# EAGLE schematic Steering Wheel V2.3 (EAGLE 7.7.0)
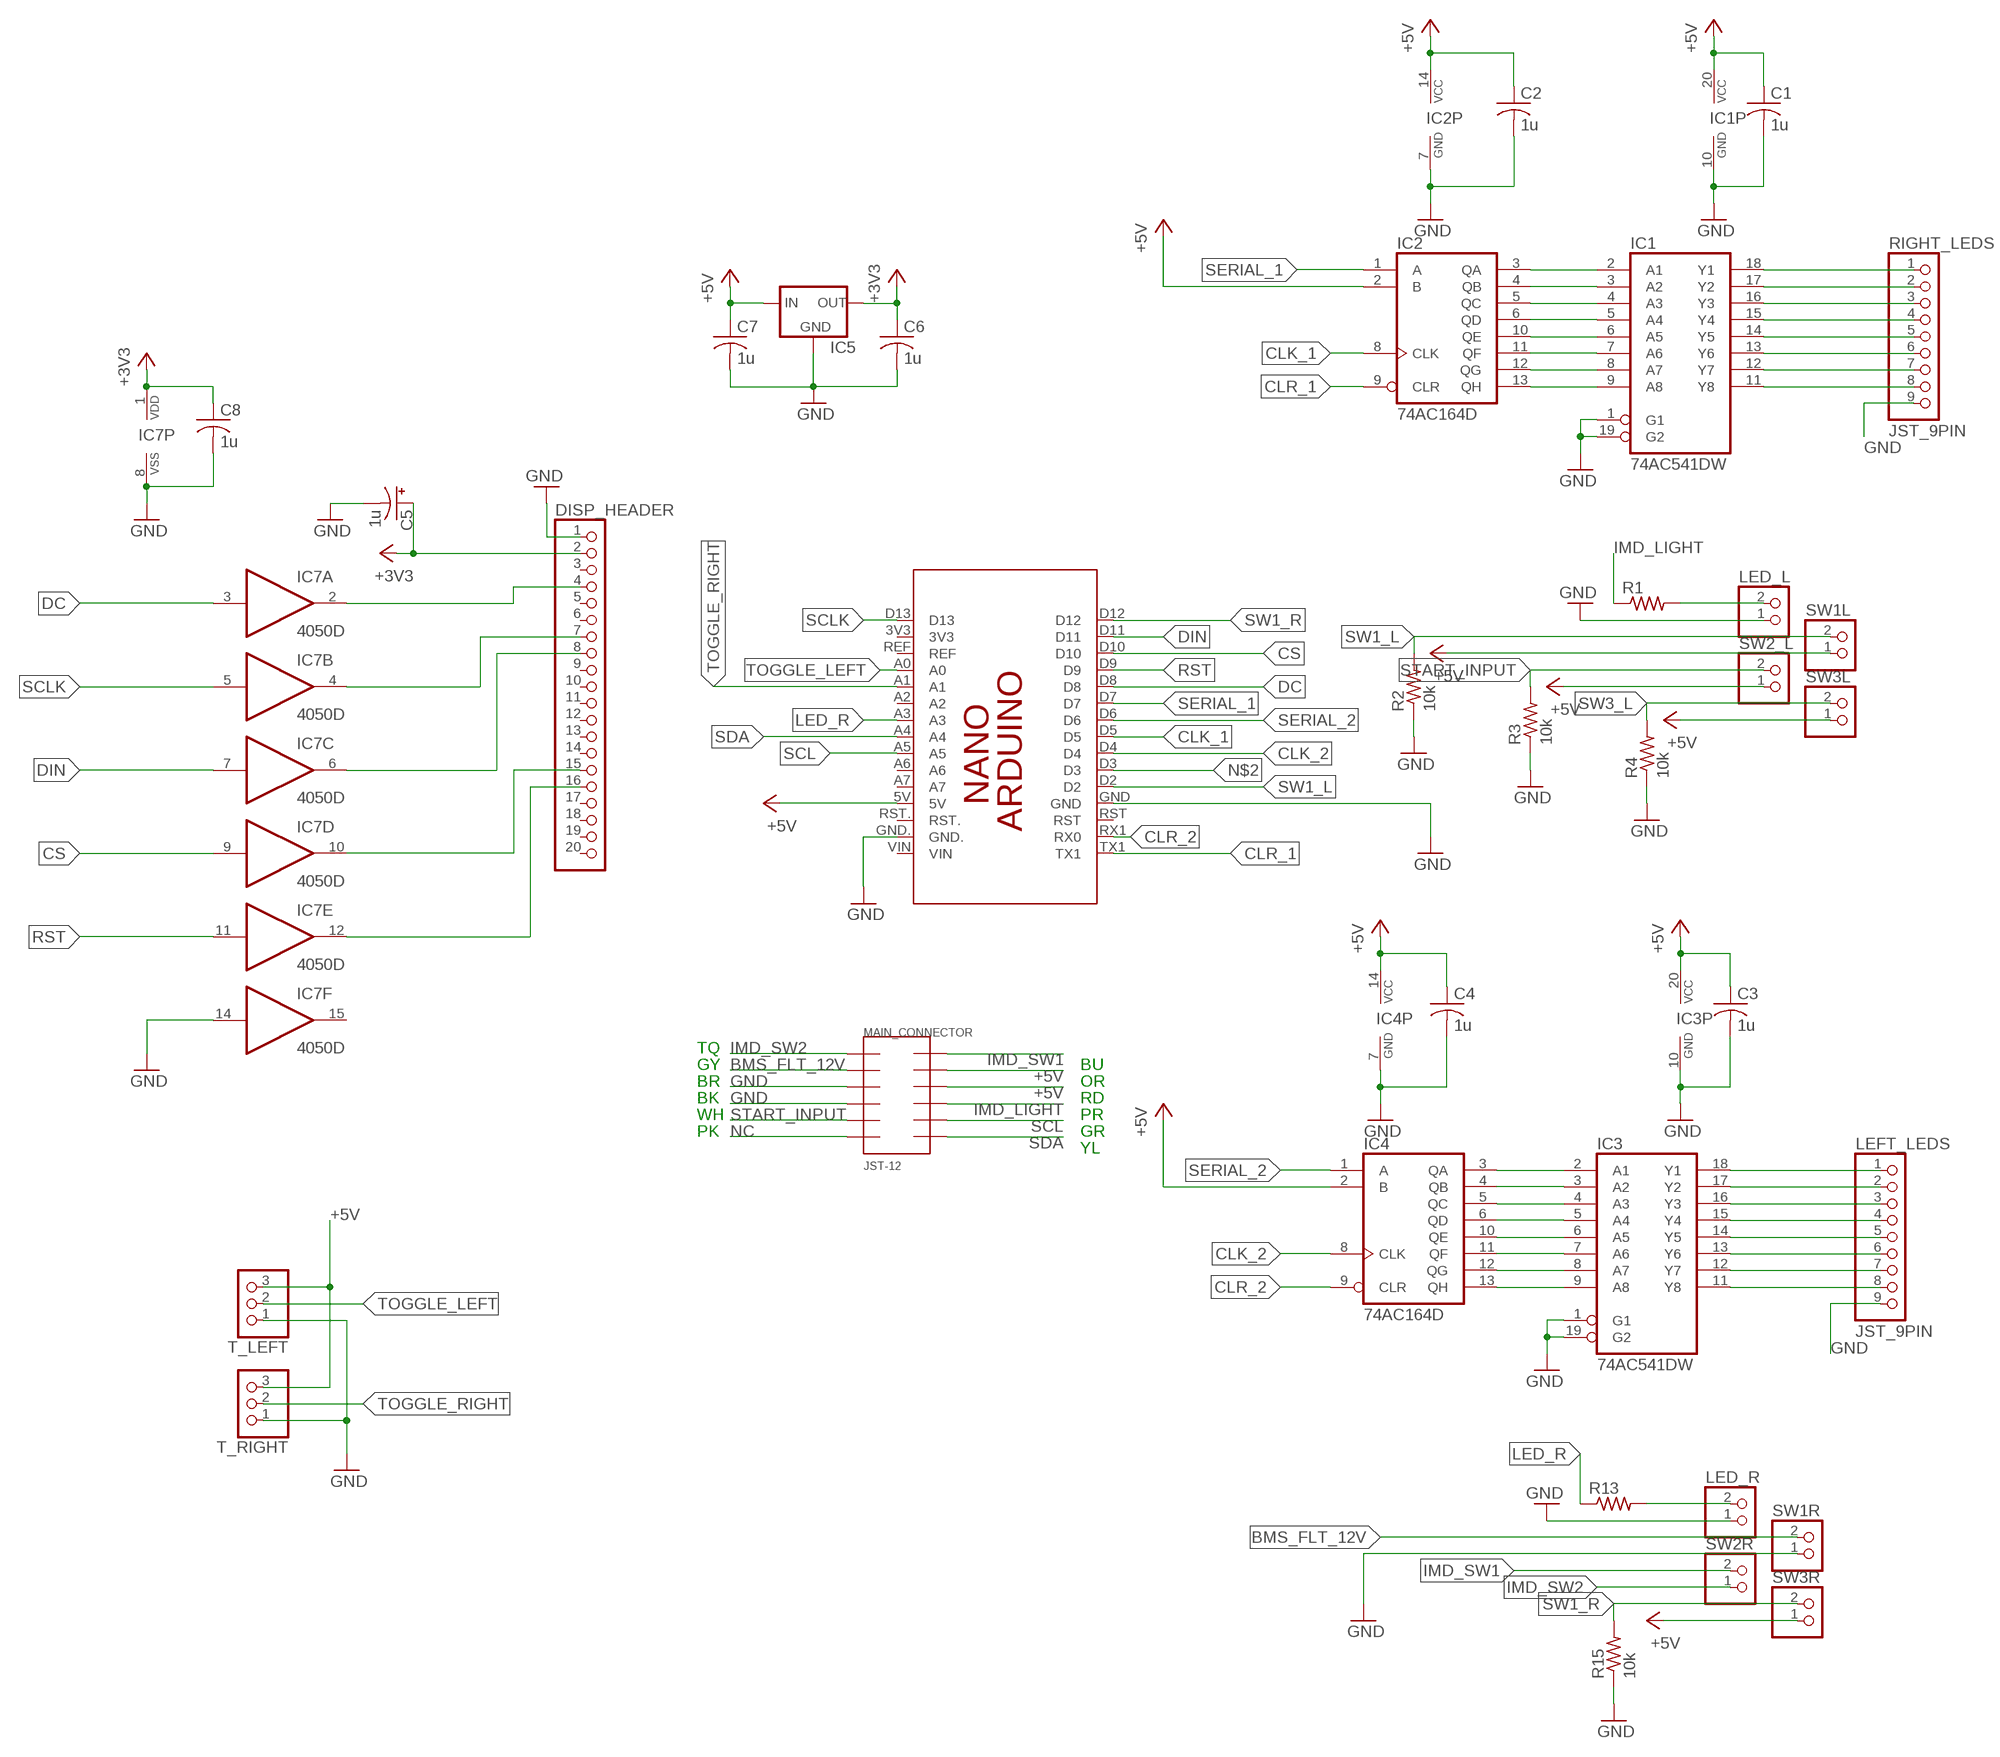
[diagram p0: schematic, sheet 1]

## Parts
C1  1u  C-USC1206  [C1206]
C2  1u  C-USC1206  [C1206]
C3  1u  C-USC1206  [C1206]
C4  1u  C-USC1206  [C1206]
C5  1u  CPOL-USE3.5-8  [E3,5-8]
C6  1u  C-USC1206  [C1206]
C7  1u  C-USC1206  [C1206]
C8  1u  C-USC1206  [C1206]
DISP_HEADER  PINHD-1X20  [1X20]
IC1  74AC541DW  [SO20W]
IC2  74AC164D  [SO14]
IC3  74AC541DW  [SO20W]
IC4  74AC164D  [SO14]
IC5  78XXL  [78XXL]
IC7  4050D  [SO16]
LED_L  JST_2PIN-THM  [JST-PH-2-THM]
LED_R  JST_2PIN-THM  [JST-PH-2-THM]
LEFT_LEDS  JST_9PIN  [JST-PH-9-THM]
MAIN_CONNECTOR  JST-12  [PHD-12]
PCB1  ARDUINO_NANO  [ARDUINO_NANO]
R1  R-US_M1206  [M1206]
R2  10k  R-US_M1206  [M1206]
R3  10k  R-US_M1206  [M1206]
R4  10k  R-US_M1206  [M1206]
R13  R-US_M1206  [M1206]
R15  10k  R-US_M1206  [M1206]
RIGHT_LEDS  JST_9PIN  [JST-PH-9-THM]
SW1L  JST_2PIN-THM  [JST-PH-2-THM]
SW1R  JST_2PIN-THM  [JST-PH-2-THM]
SW2_L  JST_2PIN-THM  [JST-PH-2-THM]
SW2R  JST_2PIN-THM  [JST-PH-2-THM]
SW3L  JST_2PIN-THM  [JST-PH-2-THM]
SW3R  JST_2PIN-THM  [JST-PH-2-THM]
T_LEFT  JST_3PIN  [JST-PH-3-THM]
T_RIGHT  JST_3PIN  [JST-PH-3-THM]

## Nets
+3V3: C5.+ C6.1 C8.1 DISP_HEADER.2 IC5.OUT IC7.1(P:VDD)
+5V: C1.1 C2.1 C3.1 C4.1 C7.1 IC1.20(VCC) IC2.2(B) IC2.14(VCC) IC3.20(VCC) IC4.2(B) IC4.14(VCC) IC5.IN MAIN_CONNECTOR.10 MAIN_CONNECTOR.11 PCB1.5V SW1L.1 SW2_L.1 SW3L.1 SW3R.1 T_LEFT.3 T_RIGHT.3
BMS_FLT_12V: MAIN_CONNECTOR.2 SW1R.2
CLK_1: IC2.8(CLK) PCB1.D5
CLK_2: IC4.8(CLK) PCB1.D4
CLR_1: IC2.9(CLR) PCB1.TX1
CLR_2: IC4.9(CLR) PCB1.RX1(RX0)
CS: IC7.9(D:I) PCB1.D10
DC: IC7.3(A:I) PCB1.D8
DIN: IC7.7(C:I) PCB1.D11
GND: C1.2 C2.2 C3.2 C4.2 C5.- C6.2 C7.2 C8.2 DISP_HEADER.1 IC1.1(G1) IC1.10(GND) IC1.19(G2) IC2.7(GND) IC3.1(G1) IC3.10(GND) IC3.19(G2) IC4.7(GND) IC5.GND IC7.8(P:VSS) IC7.14(F:I) LED_L.1 LED_R.1 LEFT_LEDS.9 MAIN_CONNECTOR.3 MAIN_CONNECTOR.4 PCB1.GND PCB1.GND. R2.1 R3.1 R4.1 R15.1 RIGHT_LEDS.9 SW1R.1 T_LEFT.1 T_RIGHT.1
IMD_LIGHT: MAIN_CONNECTOR.9 R1.1
IMD_SW1: MAIN_CONNECTOR.12 SW2R.2
IMD_SW2: MAIN_CONNECTOR.1 SW2R.1
LED_R: PCB1.A3 R13.1
LED_RIGHT: LED_R.2 R13.2
N$1: LED_L.2 R1.2
N$2: PCB1.D3
N$10: IC1.13(Y6) RIGHT_LEDS.6
N$14: IC1.15(Y4) RIGHT_LEDS.4
N$15: IC1.14(Y5) RIGHT_LEDS.5
N$16: IC1.12(Y7) RIGHT_LEDS.7
N$17: IC1.11(Y8) RIGHT_LEDS.8
N$18: IC1.9(A8) IC2.13(QH)
N$19: IC1.2(A1) IC2.3(QA)
N$20: IC1.3(A2) IC2.4(QB)
N$21: IC1.4(A3) IC2.5(QC)
N$22: IC1.5(A4) IC2.6(QD)
N$23: IC1.6(A5) IC2.10(QE)
N$24: IC1.7(A6) IC2.11(QF)
N$25: IC1.8(A7) IC2.12(QG)
N$35: IC3.18(Y1) LEFT_LEDS.1
N$36: IC3.17(Y2) LEFT_LEDS.2
N$37: IC3.16(Y3) LEFT_LEDS.3
N$38: IC3.15(Y4) LEFT_LEDS.4
N$39: IC3.14(Y5) LEFT_LEDS.5
N$40: IC3.13(Y6) LEFT_LEDS.6
N$41: IC3.12(Y7) LEFT_LEDS.7
N$42: IC3.11(Y8) LEFT_LEDS.8
N$43: IC3.9(A8) IC4.13(QH)
N$44: IC3.2(A1) IC4.3(QA)
N$45: IC3.3(A2) IC4.4(QB)
N$46: IC3.4(A3) IC4.5(QC)
N$47: IC3.5(A4) IC4.6(QD)
N$48: IC3.6(A5) IC4.10(QE)
N$49: IC3.7(A6) IC4.11(QF)
N$50: IC3.8(A7) IC4.12(QG)
N$51: DISP_HEADER.4 IC7.2(A:O)
N$52: DISP_HEADER.16 IC7.12(E:O)
N$53: DISP_HEADER.15 IC7.10(D:O)
N$54: IC1.18(Y1) RIGHT_LEDS.1
N$55: IC1.17(Y2) RIGHT_LEDS.2
N$56: IC1.16(Y3) RIGHT_LEDS.3
N$59: DISP_HEADER.7 IC7.4(B:O)
N$67: DISP_HEADER.8 IC7.6(C:O)
NC: MAIN_CONNECTOR.6
RST: IC7.11(E:I) PCB1.D9
SCL: MAIN_CONNECTOR.8 PCB1.A5
SCLK: IC7.5(B:I) PCB1.D13
SDA: MAIN_CONNECTOR.7 PCB1.A4
SERIAL_1: IC2.1(A) PCB1.D7
SERIAL_2: IC4.1(A) PCB1.D6
START_INPUT: MAIN_CONNECTOR.5 R3.2 SW2_L.2
SW1_L: PCB1.D2 R2.2 SW1L.2
SW1_R: PCB1.D12 R15.2 SW3R.2
SW3_L: R4.2 SW3L.2
TOGGLE_LEFT: PCB1.A0 T_LEFT.2
TOGGLE_RIGHT: PCB1.A1 T_RIGHT.2
Unconnected: DISP_HEADER.3 DISP_HEADER.5 DISP_HEADER.6 DISP_HEADER.9 DISP_HEADER.10 DISP_HEADER.11 DISP_HEADER.12 DISP_HEADER.13 DISP_HEADER.14 DISP_HEADER.17 DISP_HEADER.18 DISP_HEADER.19 DISP_HEADER.20 IC7.15(F:O) PCB1.3V3 PCB1.A2 PCB1.A6 PCB1.A7 PCB1.REF PCB1.RST PCB1.RST. PCB1.VIN

## Notes on the sheet
- TQ
- GY | BU
- BR | OR
- BK | RD
- WH | PR
- PK | GR
- YL

## Library data of the parts
C1-C4 C6-C8 = adafruit:C-US: CAPACITOR, American symbol
C5 = adafruit:CPOL-US: POLARIZED CAPACITOR, American symbol
DISP_HEADER = adafruit:PINHD-1X20: PIN HEADER
IC1 IC3 = 74xx-eu:74*541: Octal BUFFER and LINE DRIVER, 3-state
IC2 IC4 = 74xx-eu:74*164: 8-bit parallel out SHIFT REGISTER
IC5 = v-reg:78XXL: VOLTAGE REGULATOR
IC7 = 40xx:4050: Hex non-inverting BUFFER
LED_L LED_R SW1L SW1R SW2_L SW2R SW3L SW3R = adafruit:JST_2PIN: JST 2-Pin Connectors of various flavors SMT-RA (S2B-PH-SM4) 4UConnector #17311 SMT (B2B-PH-SM4) THM-RA (S2B-PH) THM (B2B-PH)
LEFT_LEDS RIGHT_LEDS = adafruit:JST_9PIN
MAIN_CONNECTOR = JST:JST-12
PCB1 = E14_Arduino_revB:ARDUINO_NANO: Device for representing an Arduino Nano board with a footprint in an EAGLE design. Created by Dave Young for Element14. More EAGLE documentation at: http://www.element14.com/community/community/knode/cadsoft_eagle
R1-R4 R13 R15 = adafruit:R-US_: RESISTOR, American symbol
T_LEFT T_RIGHT = adafruit:JST_3PIN